# EAGLE design LoRaNow_v1 (EAGLE 9.4.0)
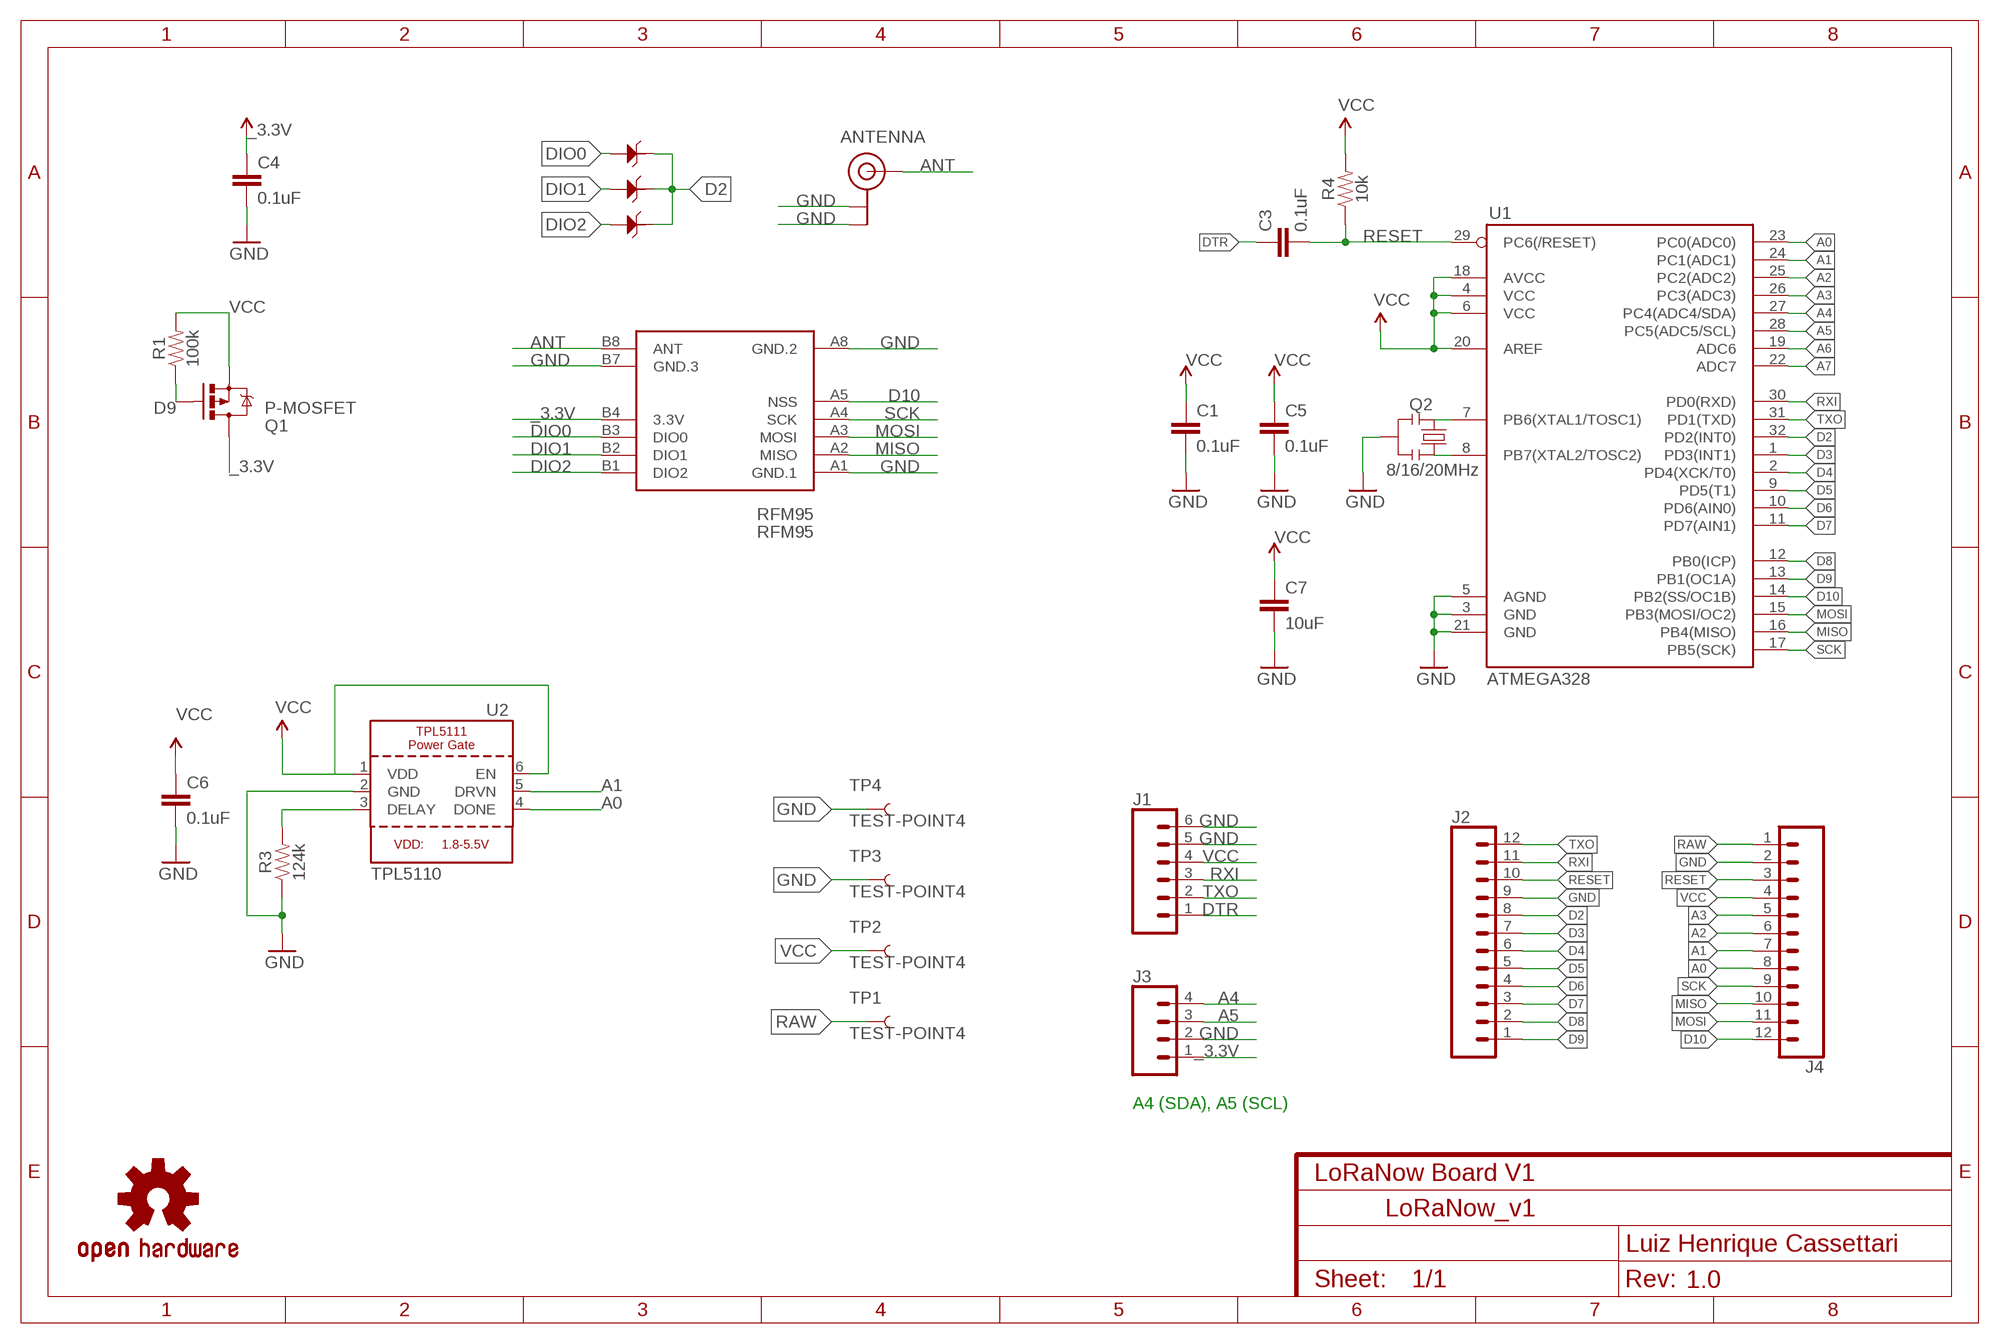
[diagram p0: schematic, sheet 1]
NAME (FRAME-A4L): CNAME: LoRaNow Board V1; CREVISION: 1.0; DESIGNER: Luiz Henrique Cassettari

## Parts
ANTENNA  U.FLU.FL_2A  [U.FL_2A]
C1  0.1uF  0.1UF-0603-25V-5%  [0603]
C3  0.1uF  0.1UF-0603-25V-5%  [0603]
C4  0.1uF  0.1UF-0603-25V-5%  [0603]
C5  0.1uF  0.1UF-0603-25V-5%  [0603]
C6  0.1uF  0.1UF-0603-25V-5%  [0603]
C7  10uF  0.1UF-0603-25V-5%  [0603]
D2  1N4148  D-ESD-2P-CESD5V0D1  [SOD123-2.7X1.6]
D3  1N4148  D-ESD-2P-CESD5V0D1  [SOD123-2.7X1.6]
D4  1N4148  D-ESD-2P-CESD5V0D1  [SOD123-2.7X1.6]
J1  CONN_06NO_SILK_FEMALE_PTH  [1X06_NO_SILK]
J2  CONN_12NO_SILK  [1X12_NO_SILK]
J3  CONN_041X04_NO_SILK  [1X04_NO_SILK]
J4  CONN_12NO_SILK  [1X12_NO_SILK]
Q1  P-MOSFET  MOSFET-PCHANNELSMD  [SOT23-3]
Q2  8/16/20MHz  RESONATOR1:1  [RESONATOR-SMD-1:1]
R1  100k  100KOHM-0603-1/10W-1%  [0603]
R3  124k  100KOHM-0603-1/10W-1%  [0603]
R4  10k  10KOHM-0603-1/10W-1%  [0603]
RFM95  RFM95  WIRELESS-LORANOW-RFM95WWIRELESS-LORANOW-RFM95W#SMD#2  [WIRELESS-LORANOW-RFM95W#SMD#2]
TP1  TEST-POINT4  [PAD.02X.04]
TP2  TEST-POINT4  [PAD.02X.04]
TP3  TEST-POINT4  [PAD.02X.04]
TP4  TEST-POINT4  [PAD.02X.04]
U1  ATMEGA328  ATMEGA168  [TQFP32-08]
U2  TPL5110  TPL5111  [SOT23-6]
U$3  OSHW-LOGOS  [OSHW-LOGO-S]

## Nets
_3.3V: C4.1 J3.1 Q1.3(D) RFM95.B4(3.3V) ; supply symbol labelled VCC
A0: J4.8 U1.23(PC0(ADC0)) U2.4(DONE)
A1: J4.7 U1.24(PC1(ADC1)) U2.5(DRVN)
A2: J4.6 U1.25(PC2(ADC2))
A3: J4.5 U1.26(PC3(ADC3))
A4: J3.4 U1.27(PC4(ADC4/SDA))
A5: J3.3 U1.28(PC5(ADC5/SCL))
A6: U1.19(ADC6)
A7: U1.22(ADC7)
ANT: ANTENNA.FEED(SIGNAL) ANTENNA.FEED.B(SIGNAL) ANTENNA.FEED.P(SIGNAL) RFM95.B8(ANT)
D2: D2.2 D3.2 D4.2 J2.8 U1.32(PD2(INT0))
D3: J2.7 U1.1(PD3(INT1))
D4: J2.6 U1.2(PD4(XCK/T0))
D5: J2.5 U1.9(PD5(T1))
D6: J2.4 U1.10(PD6(AIN0))
D7: J2.3 U1.11(PD7(AIN1))
D8: J2.2 U1.12(PB0(ICP))
D9: J2.1 Q1.1(G) R1.1 U1.13(PB1(OC1A))
D10: J4.12 RFM95.A5(NSS) U1.14(PB2(SS/OC1B))
DELAY: R3.2 U2.3(DELAY)
DIO0: D2.1 RFM95.B3(DIO0)
DIO1: D3.1 RFM95.B2(DIO1)
DIO2: D4.1 RFM95.B1(DIO2)
DTR: C3.1 J1.1
GND: ANTENNA.1(GND) ANTENNA.2(GND) ANTENNA.3(GND) ANTENNA.4(GND) ANTENNA.5(GND) ANTENNA.6(GND) C1.2 C4.2 C5.2 C6.2 C7.2 J1.5 J1.6 J2.9 J3.2 J4.2 Q2.2 R3.1 RFM95.A1(GND.1) RFM95.A8(GND.2) RFM95.B7(GND.3) TP3.P$1 TP4.P$1 U1.3(GND) U1.5(AGND) U1.21(GND) U2.2(GND)
MISO: J4.10 RFM95.A2(MISO) U1.16(PB4(MISO))
MOSI: J4.11 RFM95.A3(MOSI) U1.15(PB3(MOSI/OC2))
RAW: J4.1 TP1.P$1
RESET: C3.2 J2.10 J4.3 R4.1 U1.29(PC6(/RESET))
RXI: J1.3 J2.11 U1.30(PD0(RXD))
SCK: J4.9 RFM95.A4(SCK) U1.17(PB5(SCK))
TXO: J1.2 J2.12 U1.31(PD1(TXD))
VCC: C1.1 C5.1 C6.1 C7.1 J1.4 J4.4 Q1.2(S) R1.2 R4.2 TP2.P$1 U1.4(VCC) U1.6(VCC) U1.18(AVCC) U1.20(AREF) U2.1(VDD) U2.6(EN)
X1: Q2.1 U1.7(PB6(XTAL1/TOSC1))
X2: Q2.3 U1.8(PB7(XTAL2/TOSC2))

## Notes on the sheet
- A4 (SDA), A5 (SCL)

## Library data of the parts
ANTENNA = SparkFun-Connectors:U.FL: SMD Antenna Connector - U.FL 2mm height, 3.0mm x 3.0mm receptacle size. SparkFun Products: SparkFun WiFi Shield - ESP8266 <https://www.sparkfun.com/products/13287> SparkFun ESP8266 Thing <https://www.sparkfun.com/products/13231> SparkFun MiniGen - Pro Mini Signal Generator Shield <https://www.sparkfun.com/products/11420>
C1 C3-C6 = SparkFun-Capacitors:0.1UF: 0.1µF ceramic capacitors A capacitor is a passive two-terminal electrical component used to store electrical energy temporarily in an electric field.; PROD_ID: CAP-08604
C7 = SparkFun-Capacitors:0.1UF: 0.1µF ceramic capacitors A capacitor is a passive two-terminal electrical component used to store electrical energy temporarily in an electric field.; PROD_ID: CAP-08604; VALUE: 0.1uF
D2-D4 = Seeed-Discrete:D-ESD-2P: Diodes for Protectiong against ESD
J1 = SparkFun-Connectors:CONN_06: Multi connection point. Often used as Generic Header-pin footprint for 0.1 inch spaced/style header connections On any of the 0.1 inch spaced packages, you can populate with these: Break Away Headers - Straight <https://www.sparkfun.com/products/116> (PRT-00116) Break Away Male Headers - Right Angle <https://www.sparkfun.com/products/553> (PRT-00553) Female Headers <https://www.sparkfun.com/products/115> (PRT-00115) Break Away Headers - Machine Pin <https://www.sparkfun.com/products/117> (PRT-00117) Break Away Female Headers - Swiss Machine Pin <https://www.sparkfun.com/products/743> (PRT-00743) Arduino Stackable Header - 6 Pin <https://www.sparkfun.com/products/9280> (PRT-09280) For SCREWTERMINALS and SPRING TERMINALS visit here: Screw Terimnals on SparkFun.com <https://www.sparkfun.com/search/results?term=Screw+Terminals> (5mm/3.5mm/2.54mm spacing) This device is also useful as a general connection point to wire up your design to another part of your project. Our various solder wires solder well into these plated through hole pads. Hook-Up Wire - Assortment (Stranded, 22 AWG) <https://www.sparkfun.com/products/11375> (PRT-11375) Hook-Up Wire - Assortment (Solid Core, 22 AWG) <https://www.sparkfun.com/products/11367> (PRT-11367) View the entire wire category on our website here <https://www.sparkfun.com/categories/141>; PROD_ID: CONN-08437
J2 J4 = SparkFun-Connectors:CONN_12: Multi connection point. Often used as Generic Header-pin footprint for 0.1 inch spaced/style header connections On any of the 0.1 inch spaced packages, you can populate with these: Break Away Headers - Straight <https://www.sparkfun.com/products/116> (PRT-00116) Break Away Male Headers - Right Angle <https://www.sparkfun.com/products/553> (PRT-00553) Female Headers <https://www.sparkfun.com/products/115> (PRT-00115) Break Away Headers - Machine Pin <https://www.sparkfun.com/products/117> (PRT-00117) Break Away Female Headers - Swiss Machine Pin <https://www.sparkfun.com/products/743> (PRT-00743) For SCREWTERMINALS and SPRING TERMINALS visit here: Screw Terimnals on SparkFun.com <https://www.sparkfun.com/search/results?term=Screw+Terminals> (5mm/3.5mm/2.54mm spacing) This device is also useful as a general connection point to wire up your design to another part of your project. Our various solder wires solder well into these plated through hole pads. Hook-Up Wire - Assortment (Stranded, 22 AWG) <https://www.sparkfun.com/products/11375> (PRT-11375) Hook-Up Wire - Assortment (Solid Core, 22 AWG) <https://www.sparkfun.com/products/11367> (PRT-11367) View the entire wire category on our website here <https://www.sparkfun.com/categories/141> Special notes: Molex polarized connector foot print use with SKU : PRT-08231 with associated crimp pins and housings. 1MM SMD Version SKU: PRT-10208 NOTES ON THE VARIANTS LOCK and LOCK_LONGPADS... This footprint was designed to help hold the alignment of a through-hole component (i.e. 6-pin header) while soldering it into place. You may notice that each hole has been shifted either up or down by 0.005 of an inch from it's more standard position (which is a perfectly straight line). This slight alteration caused the pins (the squares in the middle) to touch the edges of the holes. Because they are alternating, it causes a "brace" to hold the component in place. 0.005 has proven to be the perfect amount of "off-center" position when using our standard breakaway headers. Although looks a little odd when you look at the bare footprint, once you have a header in there, the alteration is very hard to notice. Also,if you push a header all the way into place, it is covered up entirely on the bottom side.
J3 = SparkFun-Connectors:CONN_04: Multi connection point. Often used as Generic Header-pin footprint for 0.1 inch spaced/style header connections On any of the 0.1 inch spaced packages, you can populate with these: Break Away Headers - Straight <https://www.sparkfun.com/products/116> (PRT-00116) Break Away Male Headers - Right Angle <https://www.sparkfun.com/products/553> (PRT-00553) Female Headers <https://www.sparkfun.com/products/115> (PRT-00115) Break Away Headers - Machine Pin <https://www.sparkfun.com/products/117> (PRT-00117) Break Away Female Headers - Swiss Machine Pin <https://www.sparkfun.com/products/743> (PRT-00743) For SCREWTERMINALS and SPRING TERMINALS visit here: Screw Terimnals on SparkFun.com <https://www.sparkfun.com/search/results?term=Screw+Terminals> (5mm/3.5mm/2.54mm spacing) This device is also useful as a general connection point to wire up your design to another part of your project. Our various solder wires solder well into these plated through hole pads. Hook-Up Wire - Assortment (Stranded, 22 AWG) <https://www.sparkfun.com/products/11375> (PRT-11375) Hook-Up Wire - Assortment (Solid Core, 22 AWG) <https://www.sparkfun.com/products/11367> (PRT-11367) View the entire wire category on our website here <https://www.sparkfun.com/categories/141> Special notes: Molex polarized connector foot print use with SKU : PRT-08231 with associated crimp pins and housings. 1MM SMD Version SKU: PRT-10208; PROD_ID: CONN-09696
Q1 = User-Submitted:MOSFET-PCHANNEL: Generic PMOSFET IRLML2244 - TRANS-11153 (SOT-23 -20V -4.3A) (1.Gate 2.Source 3.Drain) FQP27P06 - COM-10349 <http://www.sparkfun.com/products/10349> (TO-220 -60V -27A) (1.Gate 2.Source 3.Drain)
Q2 = Testing:RESONATOR: Resonator Small SMD resonator. This is the itty bitty 10/20MHz resonators with built in caps. CSTCE10M0G55 and CSTCE20M0V53. Footprint for SMD has been used in SFE production for years, and does work okay. 1:1 is an attempt to get larger fillets on the sides so it will be easier to inspect these solders in our AOI machine. The pads have been minimized to match the actual metal under the resonator. To see this relation, it includes an image import of the bottom side of the component. Imported to scale on layer 200.
R1 = SparkFun-Resistors:100KOHM: 100kΩ resistor A resistor is a passive two-terminal electrical component that implements electrical resistance as a circuit element. Resistors act to reduce current flow, and, at the same time, act to lower voltage levels within circuits. - Wikipedia; PROD_ID: RES-07828
R3 = SparkFun-Resistors:100KOHM: 100kΩ resistor A resistor is a passive two-terminal electrical component that implements electrical resistance as a circuit element. Resistors act to reduce current flow, and, at the same time, act to lower voltage levels within circuits. - Wikipedia; PROD_ID: RES-07828; VALUE: 100k
R4 = SparkFun-Resistors:10KOHM: 10kΩ resistor A resistor is a passive two-terminal electrical component that implements electrical resistance as a circuit element. Resistors act to reduce current flow, and, at the same time, act to lower voltage levels within circuits. - Wikipedia; PROD_ID: RES-00824
RFM95 = diy-modules:WIRELESS-LORANOW-RFM95W: 868/915 MHz LoRa Radio Transceiver Module based on SX1276 chip Click here to find device on ebay.com <http://www.ebay.com/sch/RFM95W+transceiver>
TP1-TP4 = SparkFun-Connectors:TEST-POINT: SparkFun Test Points Bare copper test points for troubleshooting or In-Circuit-Testing. These are used by our Production team for verifying production board runs using pogo-pins on test beds. SparkFun Products: SparkFun LSM9DS1 Breakout <https://www.sparkfun.com/products/13284> SparkFun PSOC <https://www.sparkfun.com/products/13714> SparkFun Load Cell Amplifier <https://www.sparkfun.com/products/13879>
U1 = SparkFun:ATMEGA168
U2 = microbuilder:TPL5111: TPL5111 Timer Based Power Gate Selectable Time Intervals: 100 ms to 7200 s Current Consumption at 2.5 V: 35 nA (typical) Supply Voltage Range: 1.8 V to 5.5 V
U$3 = SparkFun:OSHW-LOGO: Open Source Hardware Logo This logo indicates the piece of hardware it is found on incorporates a OSHW license and/or adheres to the definition of open source hardware found here: http://freedomdefined.org/OSHW

## Net classes
0 default: clearance 0.205 mm
1 vcc: width 0.254 mm

## Board
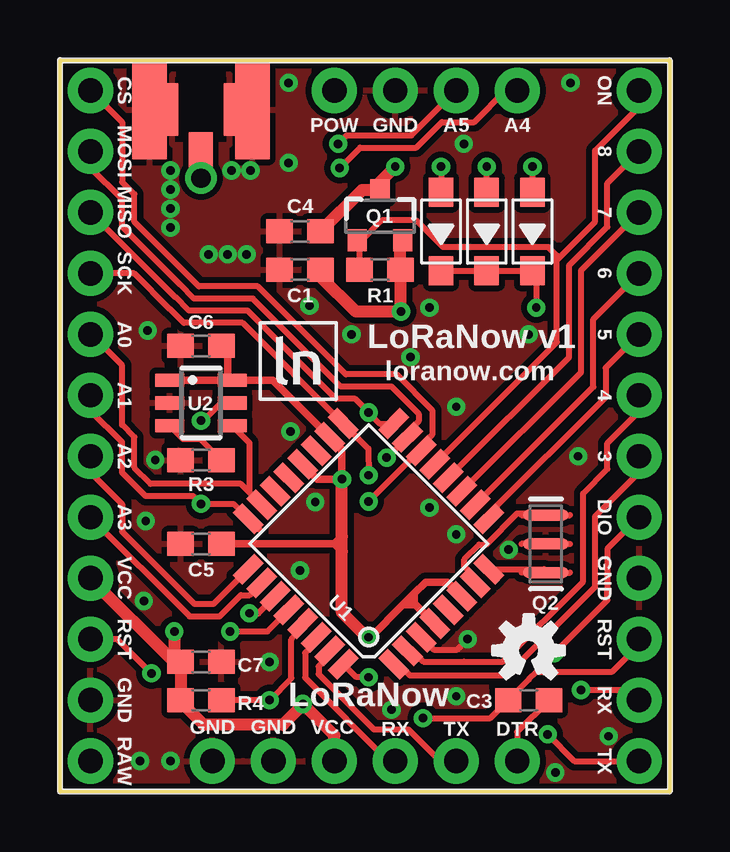
[diagram p1: board, top side]
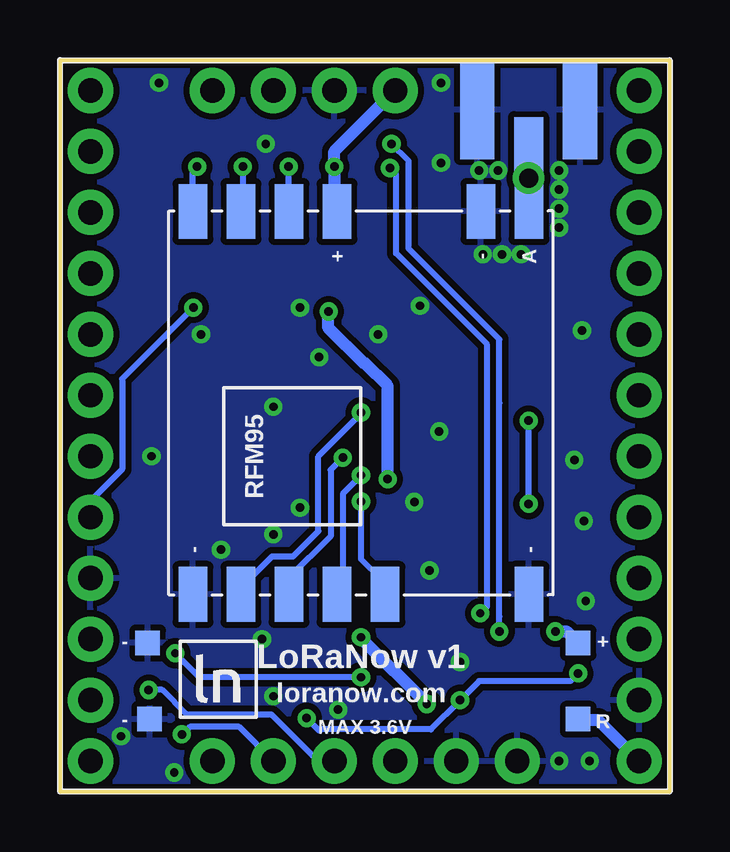
[diagram p2: board, bottom side, seen from below]

Size 25.4 x 30.48 mm. Coordinates in mm from the lower left corner, seen from the top.
Outline: 0,0 0,30.48 25.4,30.48 25.4,0 0,0
Copper layers (1*16): Top 0.035mm / dielectric 1.5mm / Bottom 0.035mm
Design rules "JLC_": minimum track width 10mil, minimum drill 0.3mm, track to track 10mil, track to pad 10mil, pad to pad 10mil, via to via 10mil, smd to smd 1mil, copper to edge 1mil, drill to drill 8mil, minimum pad ring 10mil, minimum via ring 8mil, stop-mask expansion 4mil, vias tented up to drill 15mil, thermal gap 10mil

### Footprints (pad centres in the part's own frame; a part is rotated, then mirrored left to right if it is on the bottom)
U.FL_2A = smd 2.203 x 0.476: 1 0,1.191; 2 0,-1.191 | smd 4.128 x 1.429: 3 0,2.143; 4 0,-2.143 | smd 4.128 x 1.429 bottom: 5 0,2.143; 6 0,-2.143 | smd 1.905 x 1: FEED 1.905,0 | smd 2.54 x 1.206 bottom: FEED.B 1.587,0 | drill 0.8: FEED.P 2.857,0
0603 = smd 1.1 x 1: 1 -0.85,0; 2 0.85,0
SOD123-2.7X1.6 = smd 1.2 x 1.02: 1 -1.635,0; 2 1.635,0
1X06_NO_SILK = drill 1.016 pad 1.88: 1 0,0; 2 2.54,0; 3 5.08,0; 4 7.62,0; 5 10.16,0; 6 12.7,0
1X12_NO_SILK = drill 1.016 pad 1.88: 1 0,0; 2 2.54,0; 3 5.08,0; 4 7.62,0; 5 10.16,0; 6 12.7,0; 7 15.24,0; 8 17.78,0; 9 20.32,0; 10 22.86,0; 11 25.4,0; 12 27.94,0
1X04_NO_SILK = drill 1.016 pad 1.88: 1 0,0; 2 2.54,0; 3 5.08,0; 4 7.62,0
SOT23-3 = smd 0.8 x 0.9: 1 -0.95,-1; 2 0.95,-1; 3 0,1.1
RESONATOR-SMD-1:1 = smd 0.45 x 1.905: 1 -1.2,0; 2 0,0; 3 1.2,0
WIRELESS-LORANOW-RFM95W#SMD#2 = smd 2.286 x 1.2: A1 -7.976,7; A2 -7.976,5; A3 -7.976,3; A4 -7.976,1; A5 -7.976,-1; A8 -7.976,-7; B1 7.976,7; B2 7.976,5; B3 7.976,3; B4 7.976,1; B7 7.976,-5; B8 7.976,-7
PAD.02X.04 = smd 1.016 x 1.016: P$1 0,0
TQFP32-08 = smd 1.27 x 0.559: 1 -4.293,2.8; 2 -4.293,2; 3 -4.293,1.2; 4 -4.293,0.4; 5 -4.293,-0.4; 6 -4.293,-1.2; 7 -4.293,-2; 8 -4.293,-2.8; 17 4.293,-2.8; 18 4.293,-2; 19 4.293,-1.2; 20 4.293,-0.4; 21 4.293,0.4; 22 4.293,1.2; 23 4.293,2; 24 4.293,2.8 | smd 0.559 x 1.27: 9 -2.8,-4.293; 10 -2,-4.293; 11 -1.2,-4.293; 12 -0.4,-4.293; 13 0.4,-4.293; 14 1.2,-4.293; 15 2,-4.293; 16 2.8,-4.293; 25 2.8,4.293; 26 2,4.293; 27 1.2,4.293; 28 0.4,4.293; 29 -0.4,4.293; 30 -1.2,4.293; 31 -2,4.293; 32 -2.8,4.293
SOT23-6 = smd 0.55 x 1.2: 1 -0.95,-1.3; 2 0,-1.3; 3 0.95,-1.3; 4 0.95,1.3; 5 0,1.3; 6 -0.95,1.3

### Placement (x,y rotation side)
ANTENNA  5.87,28.42 270 top
C1  10,21.75 180 top
C3  19.53,3.81 180 top
C4  10,23.34 180 top
C5  5.87,10.32 180 top
C6  5.87,18.57 180 top
C7  5.87,5.4 0 top
D2  15.88,23.34 270 top
D3  17.78,23.34 270 top
D4  19.68,23.34 270 top
J1  19.05,1.27 180 top
J2  24.13,29.21 270 top
J3  11.43,29.21 0 top
J4  1.27,1.27 90 top
Q1  13.34,23.97 0 top
Q2  20.24,10.32 270 top
R1  13.34,21.75 0 top
R3  5.87,13.81 0 top
R4  5.87,3.81 180 top
RFM95  12.86,16.19 90 bottom
TP1  3.81,3.02 0 bottom
TP2  3.81,6.19 0 bottom
TP3  21.67,3.02 0 bottom
TP4  21.75,6.19 0 bottom
U1  12.86,10.32 135 top
U2  5.87,16.19 270 top
U$3  19.53,5.87 0 top
U$7  [LORANOW_SMALL_BOX]  9.92,17.94 0 top
U$8  [LORANOW_SMALL_BOX]  18.81,4.68 0 bottom

### Tracks (layer width: path | path; a pad name or v marks a point on that pad's centre or on a via)
_3.3V  (via drill 0.35)
  Top 0.254: Q1.3 13.32,24.92 | Q1.3 13.34,25.4 | 13.19,24.77 Q1.3
  Top 0.508: 13.34,25.4 v13.97,26.04 | C4.1 12.59,25.07 Q1.3
  Bottom 0.254: 14.13,24.92 14.13,23.96 RFM95.B4 13.97,23.8
  Bottom 0.508: 13.97,23.8 v13.97,26.04 13.97,26.67 J3.1
A0
  Top 0.254: J4.8 1.3,19.05 2.59,17.76 2.59,15.27 3.1,14.77 3.1,13.49 3.78,12.82 7.53,12.82 U1.23 | 8.41,12.14 U1.23 | U1.23 7.89,12.46 7.89,14.53 U2.4
A1  (via drill 0.35)
  Top 0.254: U1.24 7.84,11.57 | J4.7 1.27,15.88 2.59,14.55 2.59,13.28 3.57,12.31 5.55,12.31 v5.87,11.99 7.23,11.99 U1.24 | U1.24 8.3,10.91 | v5.87,15.45 5.97,15.45 6.71,16.19 U2.5 | 7.71,11.51 U1.24
  Bottom 0.254: v5.87,11.99 v5.87,15.45
A2
  Top 0.254: J4.6 1.27,13.3 2.59,11.98 2.59,10.83 5.6,7.82 6.4,7.82 U1.25
A3
  Top 0.254: U1.26 7.9,8.19 7.54,8.19 6.65,7.3 5.4,7.3 J4.5
A4  (via drill 0.35)
  Top 0.254: U1.27 8.27,7.43 v7.89,7.43 | J3.4 18.57,29.21 17.25,27.89 15.91,27.89 14.85,26.83 12.5,26.83 v11.65,25.98
  Bottom 0.254: v7.89,7.43 7.6,7.72 7.6,18.63 11.39,22.42 11.39,25.72 v11.65,25.98
A5  (via drill 0.35)
  Top 0.254: v7.09,6.67 8.64,6.67 U1.28 | J3.3 14.64,27.34 11.94,27.34 v11.59,26.99
  Bottom 0.254: v7.09,6.67 7.09,7.3 7.09,16.19 7.09,18.84 10.87,22.62 10.87,26.27 v11.59,26.99
ANT
  Top 0.254: ANTENNA.FEED ANTENNA.FEED.P
  Bottom 0.254: ANTENNA.FEED.P 5.86,25.54 RFM95.B8 5.87,24.18 ANTENNA.FEED.B
D2  (via drill 0.35)
  Top 0.254: D2.2 D3.2 D4.2 19.84,21.38 v19.84,20.16 | J2.8 22.81,10.11 22.81,8.32 | 22.81,8.32 | 22.81,8.32 22.81,8.34 | 22.81,8.34 | 22.81,8.34 22.81,8.41 | v12.86,4.76 12.34,4.76 U1.32 | v20.6,5.76 22.81,7.97 22.81,8.32
  Bottom 0.254: v19.84,20.16 22.81,17.2 22.81,13.42 24.13,12.1 J2.8 | v20.6,5.76 19.6,4.76 v12.86,4.76
D3
  Top 0.254: U1.1 14.11,5.3 14.57,4.84 18.61,4.84 22.3,8.54 22.3,11.47 24.13,13.3 J2.7
D4
  Top 0.254: U1.2 14.68,5.87 15.14,5.41 16.83,5.41 18.45,5.41 21.79,8.75 21.79,12.43 22.81,13.44 22.81,14.52 24.13,15.84 J2.6
D5
  Top 0.254: J2.5 22.73,17.65 22.73,16.43 17.87,11.57 U1.9
D6
  Top 0.254: U1.10 22.23,16.86 22.23,19.68 J2.4
D7
  Top 0.254: U1.11 21.72,17.48 21.72,21.72 J2.3
D8
  Top 0.254: U1.12 21.21,18.1 21.21,21.93 22.81,23.53 22.81,25.35 J2.2
D9
  Top 0.254: U1.13 20.7,18.73 20.7,22.15 | R1.1 12.48,22.87 | 12.48,22.87 Q1.1 | 12.48,22.87 13.42,23.8 14.84,23.8 15.96,22.68 20.35,22.68 20.7,22.33 20.7,22.15 | 20.7,22.15 22.3,23.75 22.3,26.71 24.13,28.54 J2.1
D10  (via drill 0.35)
  Top 0.254: J4.12 2.59,27.89 2.59,25.4 3.1,24.89 3.1,23.74 5.21,21.62 5.22,21.62 5.79,21.05 8.24,21.05 11.91,17.38 14.03,17.38 15.51,15.9 15.51,14.86 15.05,14.4 U1.14 14.97,14.2 v12.86,12.09
  Bottom 0.254: v12.86,12.09 12.86,9.68 12.06,8.89 11.83,8.89 11.86,8.86 RFM95.A5
DELAY
  Top 0.254: U2.3 5.12,14.69 5.84,14.69 R3.2
DIO0  (via drill 0.35)
  Top 0.254: v15.88,26.04 D2.1
  Bottom 0.254: RFM95.B3 15.86,26.02 v15.88,26.04
DIO1  (via drill 0.35)
  Top 0.254: D3.1 v17.78,26.04
  Bottom 0.254: v17.78,26.04 17.78,23.77 RFM95.B2
DIO2  (via drill 0.35)
  Top 0.254: v19.68,26.04 D4.1
  Bottom 0.254: RFM95.B1 19.86,25.86 v19.68,26.04
DTR
  Top 0.254: C3.1 19.05,2.48 J1.1
GND  (via drill 0.35)
  Top 0.254: U1.5 16.18,7.37 | 15.24,6.43 U1.3 15.56,5.92 16.55,5.92 v16.99,6.35 | U1.21 9.54,13.27
  other vias: 3.33,1.27 16.83,26.99 10.4,20.24 10.64,12.06 18.69,10.08 9.53,26.19 10,9.21 16.51,10.72 3.65,19.21 4.6,25.88 7.14,25.88 4.6,25.08 4.6,24.29 4.6,23.5 6.19,22.38 6.99,22.38 7.78,22.38 7.94,25.88 9.53,29.53 3.97,13.81 3.57,11.27 12.14,19.05 14.61,18.1 16.51,16.03 15.4,11.83 21.59,13.97 21.27,29.53 19.53,19.05 15.4,20.16 4.6,1.27 8.73,5.4 3.49,7.94 13.81,3.41 16.51,3.97 20.64,0.79 22.86,2.3 9.6,15
  pour Top (isolate 0.254): 26.19,30.64 26.35,-0.32 -0.32,-0.32 -0.48,30.64
  pour Bottom (isolate 0.254): 26.99,-0.95 -0.95,-0.95 -0.95,31.11 26.99,31.11
MISO  (via drill 0.35)
  Top 0.254: U1.16 13.32,15.33 v12.86,15.8 12.29,16.36 11.49,16.36 7.82,20.03 5.37,20.03 4.79,20.61 J4.10
  Bottom 0.254: RFM95.A2 17.8,8.28 17.8,8.56 16.56,9.8 15.69,9.8 14.64,10.85 14.64,13.96 12.86,15.74 v12.86,15.8
MOSI  (via drill 0.35)
  Top 0.254: J4.11 1.27,26 2.59,24.68 2.59,23.53 5,21.12 5.01,21.12 5.58,20.54 8.03,20.54 11.71,16.87 13.81,16.87 14.94,15.74 14.94,15.43 14.48,14.97 U1.15 13.62,13.91 v13.61,13.91
  Bottom 0.254: RFM95.A3 15.86,8.91 14.13,10.64 14.13,13.4 v13.61,13.91
RAW
  Bottom 0.508: J4.1 2.97,2.97 3.76,2.97 TP1.P$1
RESET  (via drill 0.35)
  Top 0.254: 10.11,6.8 U1.29 9.89,6.78 9.89,6.58 9.64,6.34 9.64,4.72 v8.73,3.81 R4.1 | v15.12,3.06 17.93,3.06 C3.2 | 18.31,3.81 C3.2 | v3.81,4.92 2.38,6.35 J4.3 | C3.2 19.54,4.67 19.87,5 23.02,5 24.13,6.11 J2.10
  Bottom 0.254: v3.81,4.92 4.13,4.6 7.94,4.6 v8.73,3.81 9.95,2.59 14.52,2.59 14.57,2.54 14.61,2.54 v15.12,3.06
RXI  (via drill 0.35)
  Top 0.254: U1.30 10.67,6.24 10.21,5.78 10.21,4.74 13.68,1.27 J1.3 | v21.7,4.23 23.71,4.23 J2.11
  Bottom 0.254: J1.3 14.64,1.27 16.58,3.21 20.11,3.21 21.14,4.23 v21.7,4.23
SCK  (via drill 0.35)
  Top 0.254: v12.86,13.18 12.85,14.29 U1.17 7.61,19.53 5.16,19.53 4.58,20.1 3.09,21.59 J4.9
  Bottom 0.254: RFM95.A4 13.86,8.49 13.62,8.73 13.62,12.4 12.86,13.16 v12.86,13.18
TXO  (via drill 0.35)
  Top 0.254: U1.31 11.24,5.67 10.78,5.21 10.78,4.89 13.08,2.59 14.52,2.59 15.76,1.35 16.59,1.35 J1.2 | v20.32,2.38 21.43,1.27 J2.12
  Bottom 0.254: J1.2 17.94,2.7 20,2.7 v20.32,2.38
VCC  (via drill 0.35)
  Top 0.254: U1.4 15.41,7 | 16.55,8.13 U1.6 16.64,8.23 16.48,8.39 | 14.19,22.71 Q1.2 | 14.19,20.11 v14.21,20 | 15.35,7.26 U1.4 | 6.99,17.14 U2.6 | 4.76,5.4 C7.1 5.02,5.24 4.76,5.5 | U1.4 15.54,7 | C1.1 10.85,21.48 | J1.4 11.48,1.32 | 10.14,3.63 v10.12,3.65
  Top 0.305: 16.28,8.59 16.48,8.39 | 16.47,8.39 16.14,8.72 15.23,8.72 14.76,8.26 | 14.29,7.78 14.76,8.26 | 15.35,7.26 14.83,7.78 14.29,7.78 | 14.76,8.26 14.76,7.83 15.34,7.26 | C5.1 11.43,10.32 | 11.43,10.32 11.75,10.64 | 11.43,10.32 11.75,10 | C6.1 6.99,18.31 6.99,17.14 | U2.1 U2.6 8.86,17.14 U1.18 11.75,14.26 v11.75,13.02 10.73,13.02 U1.20 | v12.86,6.43 12.94,6.43 14.29,7.78
  Top 0.508: 14.19,22.71 R1.2 14.19,20.11 | v14.21,20 12.32,20 10.85,21.48 | 5.02,5.24 R4.2 5.02,3.74 5.99,2.78 9.29,2.78 10.14,3.63 11.43,2.33 J1.4 | J4.4 4.76,5.4 | v4.76,6.67 4.76,5.5 | v11.75,13.02 11.75,10.64 11.75,10 11.75,7.46 12.78,6.43 v12.86,6.43 | 16.63,8.23 16.64,8.23 | 15.35,7.26 15.34,7.26 | 16.47,8.39 16.48,8.39
  Bottom 0.508: v14.21,20 14.22,19.93 14.22,19.31 12.75,17.85 12.7,17.85 11.75,16.9 v11.75,13.02 | v12.86,6.43 12.86,6.35 12.82,6.35 v10.12,3.65 | TP2.P$1 4.29,6.67 v4.76,6.67
X1
  Top 0.254: U1.7 17.31,8.89 16.85,9.36 16.85,9.67 17.46,10.29 17.75,10.29 19.05,11.59 20.09,11.59 Q2.1 19.78,11.52
X2
  Top 0.254: U1.8 20.18,9.26 Q2.3

### Text on the board
tNames: CS | ON | POW | GND | A5 | A4 | MOSI | 8 | MISO | 7 | SCK | 6 | A0 | LoRaNow v1 | 5 | loranow.com | A1 | 4 | A2 | 3 | A3 | DIO | VCC | GND | RST | RST | GND | LoRaNow | RX | GND | GND | VCC | RX | TX | DTR | RAW | TX
bNames: + | LoRaNow v1 | - | loranow.com | R | MAX 3.6V | -